# EAGLE design transistor_op-amp_v2_SIP (EAGLE 7.7.0)
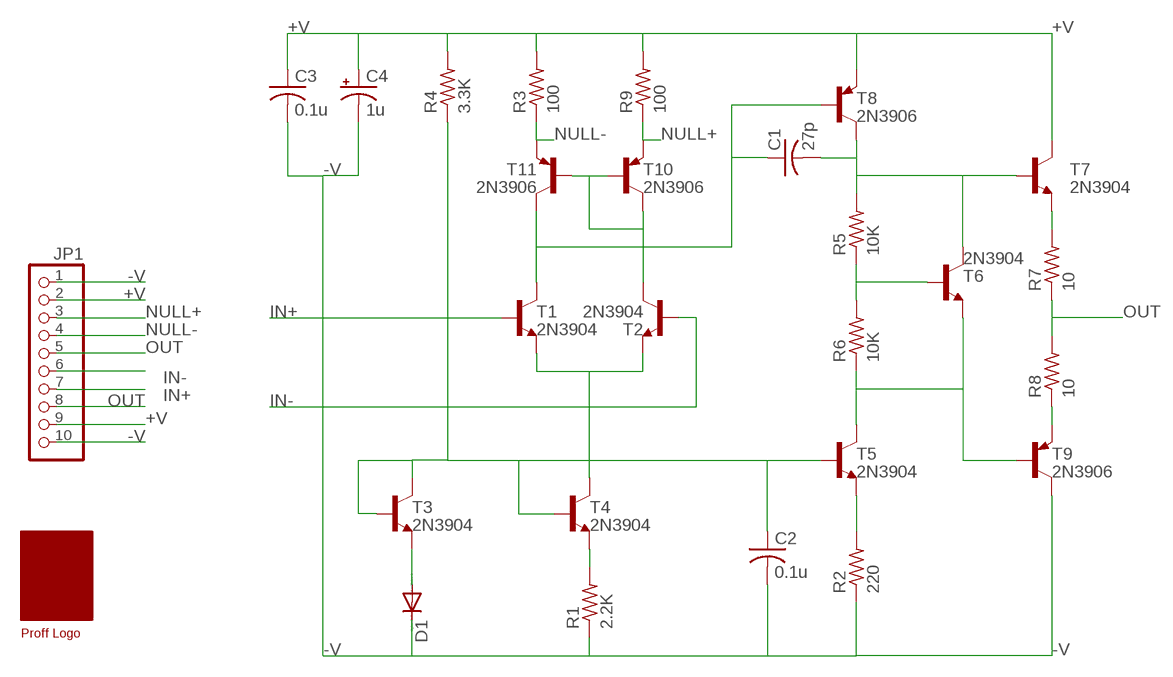
[diagram p0: schematic, sheet 1]

## Parts
C1  27p  C-US050-024X044  [C050-024X044]
C2  0.1u  C-US050-024X044  [C050-024X044]
C3  0.1u  C-US050-024X044  [C050-024X044]
C4  1u  CPOL-USE2.5-5  [E2,5-5]
D1  DIODE-D-7.5  [D-7.5]
JP1  PINHD-1X10  [1X10]
R1  2.2K  R-US_0207/7  [0207/7]
R2  220  R-US_0207/7  [0207/7]
R3  100  R-US_0207/7  [0207/7]
R4  3.3K  R-US_0207/7  [0207/7]
R5  10K  R-US_0207/7  [0207/7]
R6  10K  R-US_0207/7  [0207/7]
R7  10  R-US_0207/7  [0207/7]
R8  10  R-US_0207/7  [0207/7]
R9  100  R-US_0207/7  [0207/7]
T1  2N3904  [TO92]
T2  2N3904  [TO92]
T3  2N3904  [TO92]
T4  2N3904  [TO92]
T5  2N3904  [TO92]
T6  2N3904  [TO92]
T7  2N3904  [TO92]
T8  2N3906  [TO92]
T9  2N3906  [TO92]
T10  2N3906  [TO92]
T11  2N3906  [TO92]
U$1  PROFF  [PROFF]

## Nets
+V: C3.1 C4.+ JP1.2 JP1.9 R3.2 R4.2 R9.2 T7.1(C) T8.3(E)
-V: C2.2 C3.2 C4.- D1.C JP1.1 JP1.10 R1.1 R2.1 T9.1(C)
IN+: JP1.6 T1.2(B)
IN-: JP1.7 T2.2(B)
N$1: D1.A T3.3(E)
N$2: C2.1 R4.1 T3.1(C) T3.2(B) T4.2(B) T5.2(B)
N$3: R1.2 T4.3(E)
N$4: R2.2 T5.3(E)
N$6: T1.3(E) T2.3(E) T4.1(C)
N$8: R7.2 T7.3(E)
N$9: R6.1 T5.1(C) T6.3(E) T9.2(B)
N$10: R5.1 R6.2 T6.2(B)
N$11: C1.2 R5.2 T6.1(C) T7.2(B) T8.1(C)
N$13: R8.1 T9.3(E)
N$15: C1.1 T1.1(C) T8.2(B) T11.1(C)
N$40: T2.1(C) T10.1(C) T10.2(B) T11.2(B)
NULL+: JP1.3 R9.1 T10.3(E)
NULL-: JP1.4 R3.1 T11.3(E)
OUT: JP1.5 JP1.8 R7.1 R8.2

## Library data of the parts
C1-C3 = resistor:C-US: CAPACITOR, American symbol
C4 = rcl:CPOL-US: POLARIZED CAPACITOR, American symbol
D1 = diode:DIODE-: DIODE
JP1 = pinhead:PINHD-1X10: PIN HEADER
R1-R9 = resistor:R-US_: RESISTOR, American symbol
T1-T6 = transistor:2N3904: NPN TRANSISTOR
T7 = transistor-npn:2N3904: NPN Transistor
T8-T11 = transistor-pnp:2N3906: PNP Transistor
U$1 = logo:PROFF

## Board
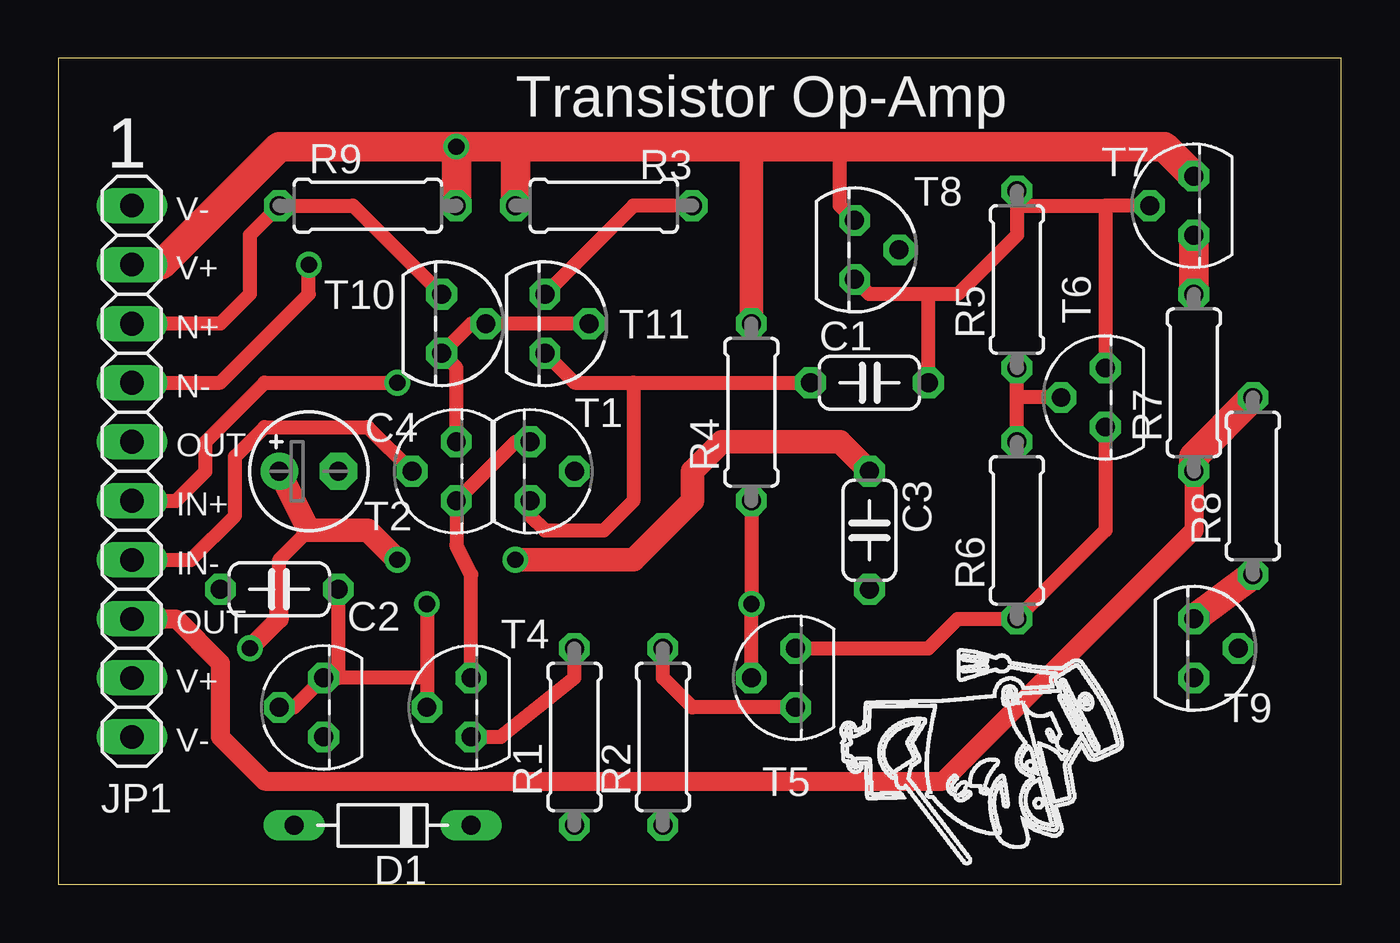
[diagram p1: board, top side]
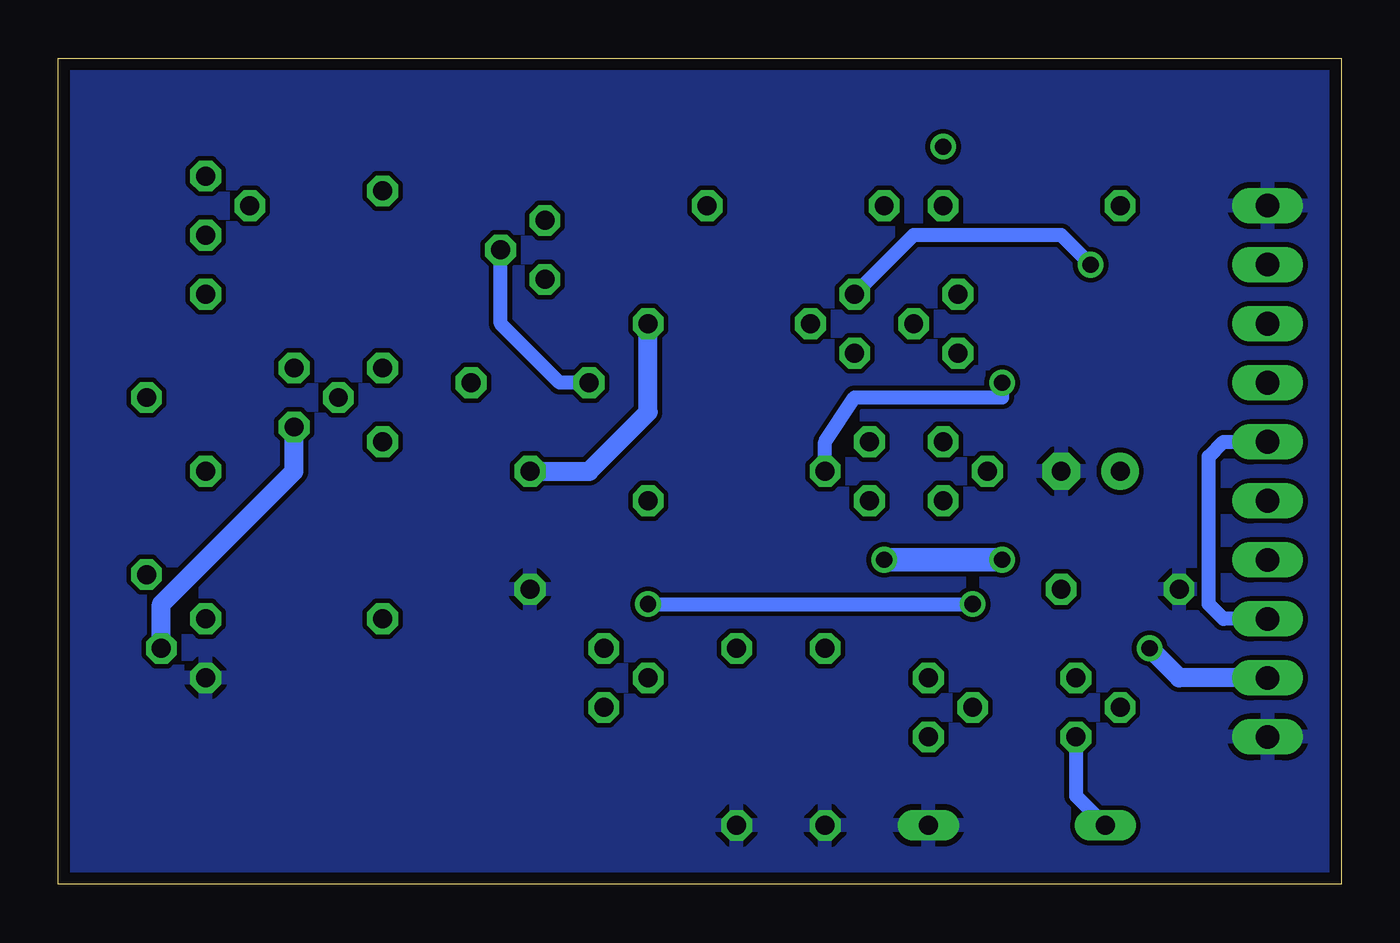
[diagram p2: board, bottom side, seen from below]

Size 55.24 x 35.56 mm. Coordinates in mm from the lower left corner, seen from the top.
Outline: 0,0 55.24,0 55.24,35.56 0,35.56 0,0
Copper layers (1*16): Top 0.035mm / dielectric 1.5mm / Bottom 0.035mm
Design rules "default *": minimum track width 10mil, minimum drill 24mil, track to track 8mil, track to pad 8mil, pad to pad 8mil, via to via 8mil, smd to smd 8mil, copper to edge 20mil, drill to drill 8mil, minimum pad ring 10mil, minimum via ring 8mil, stop-mask expansion 4mil, vias tented up to drill 0mil, thermal gap 10mil

### Footprints (pad centres in the part's own frame; a part is rotated, then mirrored left to right if it is on the bottom)
C050-024X044 = drill 0.813 octagon: 1 -2.54,0; 2 2.54,0
E2,5-5 = drill 0.813 pad 1.6: + -1.27,0 | drill 0.813 pad 1.6 octagon: - 1.27,0
D-7.5 = drill 0.813 long: A 3.81,0; C -3.81,0
1X10 = drill 1.016 long: 1 -11.43,0; 2 -8.89,0; 3 -6.35,0; 4 -3.81,0; 5 -1.27,0; 6 1.27,0; 7 3.81,0; 8 6.35,0; 9 8.89,0; 10 11.43,0
0207/7 = drill 0.813 octagon: 1 -3.81,0; 2 3.81,0
TO92 = drill 0.813 octagon: 1 1.27,0; 2 0,1.905; 3 -1.27,0

### Placement (x,y rotation side)
C1  34.92,21.59 0 top
C2  9.53,12.7 180 top
C3  34.92,15.24 270 top
C4  10.79,17.78 0 top
D1  13.97,2.54 180 top
JP1  3.17,17.78 270 top
R1  22.23,6.35 90 top
R2  26.04,6.35 90 top
R3  23.5,29.21 180 top
R4  29.84,20.32 90 top
R5  41.27,26.04 90 top
R6  41.27,15.24 90 top
R7  48.9,21.59 90 top
R8  51.44,17.14 90 top
R9  13.34,29.21 0 top
T1  20.32,17.78 270 top
T2  17.14,17.78 90 top
T3  11.43,7.62 90 top
T4  17.78,7.62 90 top
T5  31.75,8.89 90 top
T6  45.09,20.95 90 top
T7  48.9,29.21 90 top
T8  34.29,27.3 270 top
T9  48.9,10.16 270 top
T10  16.51,24.13 270 top
T11  20.95,24.13 270 top
U$1  33.66,10.16 270 top

### Tracks (layer width: path | path; a pad name or v marks a point on that pad's centre or on a via)
+V  (via drill 0.7)
  Top 0.61: T8.3 33.66,29.21 33.66,31.75 | 9.53,12.06 9.53,13.97 10.79,15.24
  Top 0.813: v8.26,10.16 9.53,11.43 9.53,12.06
  Top 1.016: R4.2 29.84,31.75 | C3.1 33.66,19.05 28.57,19.05 27.3,17.78 27.3,16.51 24.77,13.97 v19.68,13.97 | v14.61,13.97 13.34,15.24 10.79,15.24 C4.+
  Top 1.27: T7.1 47.62,31.75 33.66,31.75 29.84,31.75 19.68,31.75 | 19.68,31.75 v17.14,31.75 | R9.2 v17.14,31.75 | R3.2 19.68,31.75 | JP1.2 4.45,26.67 9.53,31.75 v17.14,31.75
  Bottom 0.813: C3.1 32.38,17.78 29.84,20.32 R4.2 | JP1.9 6.99,8.89 v8.26,10.16
  Bottom 1.016: v19.68,13.97 v14.61,13.97
-V
  pour Bottom: -0.64,-1.91 -0.64,36.2 57.78,36.2 57.78,-1.91
IN+  (via drill 0.7)
  Top 0.61: JP1.6 5.08,16.51 6.35,17.78 6.35,19.05 8.89,21.59 v14.61,21.59
  Bottom 0.61: T1.2 22.23,19.05 20.95,20.95 14.61,20.95 v14.61,21.59
IN-
  Top 0.61: JP1.7 5.71,13.97 7.62,15.88 7.62,18.41 8.89,19.68 13.34,19.68 T2.2
N$1
  Bottom 0.61: T3.3 11.43,3.81 D1.A
N$2  (via drill 0.7)
  Top 0.61: T5.2 v29.84,12.06 R4.1 | T3.2 10.16,7.62 T3.1 12.06,8.89 | 15.88,8.89 12.06,8.89 | v15.88,12.06 15.88,8.89 | 15.88,8.89 T4.2 | C2.1 12.06,8.89
  Bottom 0.61: v29.84,12.06 v15.88,12.06
N$3
  Top 0.61: T4.3 19.05,6.35 22.23,8.89 R1.2
N$4
  Top 0.61: T5.3 27.3,7.62 26.04,8.89 R2.2
N$6
  Top 0.61: T4.1 17.78,13.34 17.14,14.61 T2.3 19.68,19.05 T1.3
N$8
  Top 1.27: T7.3 R7.2
N$9
  Top 0.61: T5.1 37.47,10.16 38.73,11.43 R6.1 45.09,15.24 T6.3
  Bottom 0.813: T9.2 50.8,12.06 45.09,17.78 T6.3
N$10
  Top 0.61: T6.2 41.27,20.95 | R6.2 41.27,20.95 | 41.27,20.95 R5.1
N$11
  Top 0.61: 45.09,29.21 41.27,29.21 R5.2 41.27,27.94 38.73,25.4 37.47,25.4 | T7.2 45.09,29.21 | 45.09,29.21 T6.1 | C1.2 37.47,25.4 | 37.47,25.4 34.92,25.4 T8.1
N$13
  Top 1.27: R8.1 T9.3
N$15
  Top 0.61: T1.1 20.32,15.88 20.95,15.24 23.5,15.24 24.77,16.51 24.77,21.59 | 24.77,21.59 C1.1 | T11.1 22.23,21.59 24.77,21.59
  Bottom 0.61: C1.1 33.66,21.59 36.2,24.13 T8.2
N$40
  Top 0.61: T2.1 17.14,22.23 T10.1 17.78,24.13 T10.2 T11.2
NULL+
  Top 0.61: T10.3 12.7,29.21 R9.1 8.26,27.94 8.26,25.4 6.99,24.13 JP1.3
NULL-  (via drill 0.7)
  Top 0.61: R3.1 24.77,29.21 T11.3 | JP1.4 6.99,21.59 10.79,25.4 v10.79,26.67
  Bottom 0.61: v10.79,26.67 12.06,27.94 18.41,27.94 T11.3
OUT
  Top 0.813: JP1.8 5.08,11.43 6.99,9.53 6.99,6.35 8.89,4.45 38.1,4.45 48.9,15.24 R7.1
  Top 1.27: R7.1 48.9,18.41 R8.2
  Bottom 0.61: JP1.8 5.08,11.43 5.71,12.06 5.71,18.41 5.08,19.05 JP1.5

### Text on the board
tNames: 1 | Transistor Op-Amp | V- | V+ | N+ | N- | OUT | IN+ | IN- | OUT | V+ | V-